# Altium schematic sheet TIDA-00620_Schematic.SchDoc: System Schematic
size 431 x 279 mm; Date: Not shown in title block; ApprovedBy: Not shown in title block; CheckedBy: Not shown in title block; Author: Not shown in title block; CompanyName: Not shown in title block; DrawnBy: Koh Hamasaki; Engineer: Not shown in title block; Organization: Not shown in title block; Address1: Not shown in title block; Address2: Not shown in title block; Address3: Not shown in title block; Address4: Not shown in title block; DocumentNumber: 1; Revision: Use project parameter SCH_Rev; SheetNumber: 1; SheetTotal: 2; PageSetup: Record=PageOptions|CenterHorizontal=True|CenterVertical=True|PrintScale=0.64|XCorrection=1.00|YCorrection=1.00|PrintKind=0|BorderSize=5000000|LeftOffset=0|BottomOffset=0|Orientation=2|PaperLength=1000|PaperWidth=1000|Scale=100|PaperSource=15|PrintQuality=600|MediaType=1|DitherType=10|PrintScaleMode=1|PaperKind=Letter; CurrentTime: Not shown in title block; CurrentDate: Not shown in title block; Time: Not shown in title block; DocumentFullPathAndName: Not shown in title block; DocumentName: Not shown in title block; ModifiedDate: Not shown in title block; ImagePath: Not shown in title block
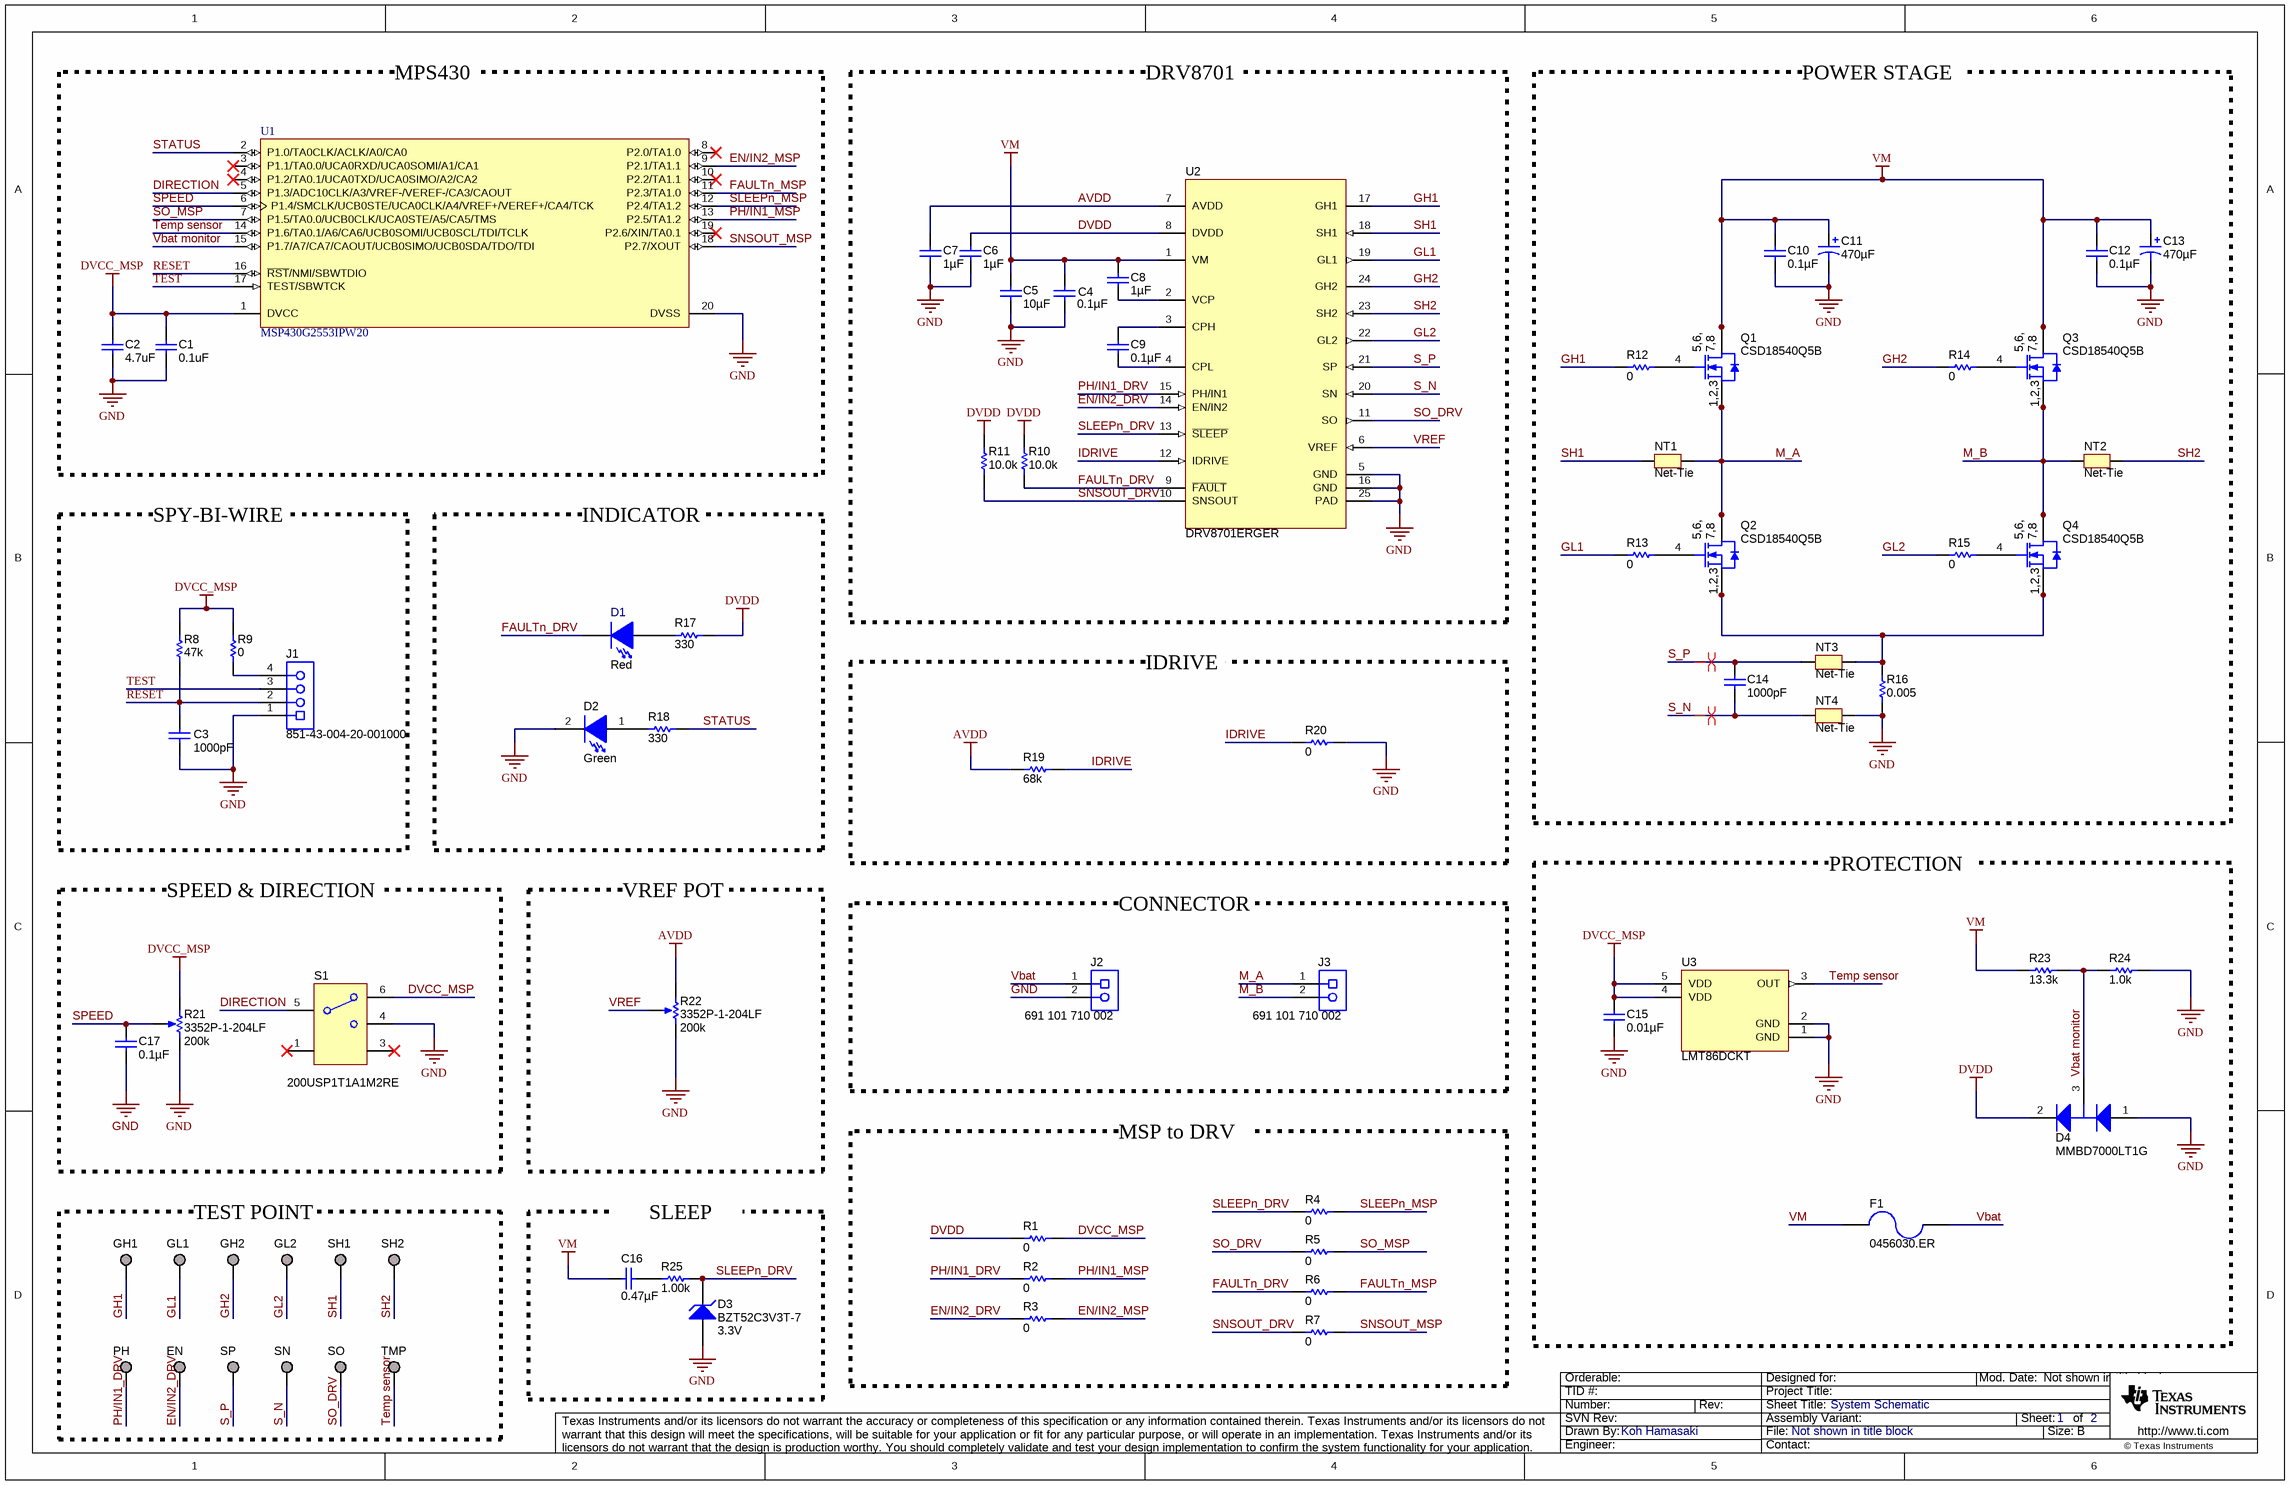
[diagram p0: TIDA-00620_Schematic.SchDoc]

## Parts
C1  ValueDisplayed: 0.1uF  [0603L]  (hidden comment: C0603C104K8RACTU)
C2  ValueDisplayed: 4.7uF  [0805L]  (hidden comment: C2012X7R1A475M)
C3  ValueDisplayed: 1000pF  [0603L]  (hidden comment: GRM188R71C102KA01D)
C4  ValueDisplayed: 0.1µF  [1206L]  (hidden comment: GRM319R71H104KA01D)
C5  ValueDisplayed: 10µF  [1210L]  (hidden comment: GRM32ER71H106KA12L)
C6  ValueDisplayed: 1µF  [0603L]  (hidden comment: GRM188R60J105KA01D)
C7  ValueDisplayed: 1µF  [0603L]  (hidden comment: GRM188R60J105KA01D)
C8  ValueDisplayed: 1µF  [1206L]  (hidden comment: GRM319R71C105KAA3D)
C9  ValueDisplayed: 0.1µF  [0402L]  (hidden comment: GRM155R71C104KA88D)
C10  ValueDisplayed: 0.1µF  [1206L]  (hidden comment: GRM319R71H104KA01D)
C11  ValueDisplayed: 470µF  [CAPPRD350W60D800H2000]  (hidden comment: EEU-FR1V471LB)
C12  ValueDisplayed: 0.1µF  [1206L]  (hidden comment: GRM319R71H104KA01D)
C13  ValueDisplayed: 470µF  [CAPPRD350W60D800H2000]  (hidden comment: EEU-FR1V471LB)
C14  ValueDisplayed: 1000pF  [0402L]  (hidden comment: GRM155R71C102KA01D)
C15  ValueDisplayed: 0.01µF  [0603L]  (hidden comment: GRM188R70J103KA01D)
C16  ValueDisplayed: 0.47µF  [0402L]  (hidden comment: GRM155R61A474KE15D)
C17  ValueDisplayed: 0.1µF  [0402]  (hidden comment: GCM155R71C104KA55D)
D1  value Red  [LED_LTST-C170]  (hidden comment: nFAULT)
D2  value Green  [LED_LTST-C171]  (hidden comment: LTST-C171GKT)
D3  BZT52C3V3T-7  value 3.3V  [SOD-523]
D4  MMBD7000LT1G  [SOT-23]
EN  TESTPOINT  [TP_25MIL-SMT]  (value not drawn)  (no BOM)
F1  0456030.ER  [FUSE_0456030]
GH1  TESTPOINT  [TP_25MIL-SMT]  (value not drawn)  (no BOM)
GH2  TESTPOINT  [TP_25MIL-SMT]  (value not drawn)  (no BOM)
GL1  TESTPOINT  [TP_25MIL-SMT]  (value not drawn)  (no BOM)
GL2  TESTPOINT  [TP_25MIL-SMT]  (value not drawn)  (no BOM)
J1  851-43-004-20-001000  [CONN_851-43-004-20-001000]
J2  691 101 710 002  [Wurth_691101710002]
J3  691 101 710 002  [Wurth_691101710002]
NT1  Net-Tie  [Net-Tie_10milWide_30milLong]  (net tie, no BOM)
NT2  Net-Tie  [Net-Tie_10milWide_30milLong]  (net tie, no BOM)
NT3  Net-Tie  [Net-Tie_10milWide_30milLong]  (net tie, no BOM)
NT4  Net-Tie  [Net-Tie_10milWide_30milLong]  (net tie, no BOM)
PH  TESTPOINT  [TP_25MIL-SMT]  (value not drawn)  (no BOM)
Q1  CSD18540Q5B  [TRANS_NexFET_Q5B]
Q2  CSD18540Q5B  [TRANS_NexFET_Q5B]
Q3  CSD18540Q5B  [TRANS_NexFET_Q5B]
Q4  CSD18540Q5B  [TRANS_NexFET_Q5B]
R1  ValueDisplayed: 0  [0402L]  (hidden comment: CRCW04020000Z0ED)
R2  ValueDisplayed: 0  [0402L]  (hidden comment: CRCW04020000Z0ED)
R3  ValueDisplayed: 0  [0402L]  (hidden comment: CRCW04020000Z0ED)
R4  ValueDisplayed: 0  [0402L]  (hidden comment: CRCW04020000Z0ED)
R5  ValueDisplayed: 0  [0402L]  (hidden comment: CRCW04020000Z0ED)
R6  ValueDisplayed: 0  [0402L]  (hidden comment: CRCW04020000Z0ED)
R7  ValueDisplayed: 0  [0402L]  (hidden comment: CRCW04020000Z0ED)
R8  value 47k  [0603L]  (hidden comment: CRCW060347K0JNEA)
R9  value 0  [0603L]  (hidden comment: CRCW06030000Z0EA)
R10  ValueDisplayed: 10.0k  [0402L]  (hidden comment: ERJ-2RKF1002X)
R11  ValueDisplayed: 10.0k  [0402L]  (hidden comment: ERJ-2RKF1002X)
R12  ValueDisplayed: 0  [0402L]  (hidden comment: CRCW04020000Z0ED)
R13  ValueDisplayed: 0  [0402L]  (hidden comment: CRCW04020000Z0ED)
R14  ValueDisplayed: 0  [0402L]  (hidden comment: CRCW04020000Z0ED)
R15  ValueDisplayed: 0  [0402L]  (hidden comment: CRCW04020000Z0ED)
R16  ValueDisplayed: 0.005  [4320]  (hidden comment: KRL11050-C-R005-F-T1)
R17  ValueDisplayed: 330  [0603L]  (hidden comment: RC0603FR-07330RL)
R18  ValueDisplayed: 330  [0603L]  (hidden comment: RC0603FR-07330RL)
R19  ValueDisplayed: 68k  [0402]  (hidden comment: CRCW040268K0JNED)
R20  ValueDisplayed: 0  [0402L]  (hidden comment: CRCW04020000Z0ED)
R21  3352P-1-204LF  value 200k  [Bourns_3352P]
R22  3352P-1-204LF  value 200k  [Bourns_3352P]
R23  ValueDisplayed: 13.3k  [0402L]  (hidden comment: CRCW040213K3FKED)
R24  ValueDisplayed: 1.0k  [0402L]  (hidden comment: CRCW04021K00JNED)
R25  ValueDisplayed: 1.00k  [0402L]  (hidden comment: CRCW04021K00FKED)
S1  200USP1T1A1M2RE  [SW_200USP1T1A1M2]
SH1  TESTPOINT  [TP_25MIL-SMT]  (value not drawn)  (no BOM)
SH2  TESTPOINT  [TP_25MIL-SMT]  (value not drawn)  (no BOM)
SN  TESTPOINT  [TP_25MIL-SMT]  (value not drawn)  (no BOM)
SO  TESTPOINT  [TP_25MIL-SMT]  (value not drawn)  (no BOM)
SP  TESTPOINT  [TP_25MIL-SMT]  (value not drawn)  (no BOM)
TMP  TESTPOINT  [TP_25MIL-SMT]  (value not drawn)  (no BOM)
U1  MSP430G2553IPW20  [PW0020A_N]
U2  DRV8701ERGER  [RGE0024F]
U3  LMT86DCKT  [DCK0005A_N]

## Nets
AVDD: C7.1 R19.1 R22.1(CCW) U2.7(AVDD)
DVCC_MSP: C1.1 C2.1 C15.1 R1.2 R8.2 R9.2 R21.1(CCW) S1.6 U1.1(DVCC) U3.4(VDD) U3.5(VDD)
DVDD: C6.1 D4.2(K) R1.1 R10.2 R11.2 R17.2 U2.8(DVDD)
GND: C1.2 C2.2 C3.2 C4.2 C5.2 C6.2 C7.2 C10.2 C11.2(-) C12.2 C13.2(-) C15.2 C17.2 D2.2(K) D3.2(A) D4.1(A) J1.1 J2.2 NT4.2 R16.1 R20.2 R21.3(CW) R22.3(CW) R24.2 S1.4 U1.20(DVSS) U2.5(GND) U2.16(GND) U2.25(PAD) U3.1(GND) U3.2(GND)
VM: C4.1 C5.1 C8.1 C10.1 C11.1(+) C12.1 C13.1(+) C16.2 F1.2 Q1.5(D) Q1.6(D) Q1.7(D) Q1.8(D) Q3.5(D) Q3.6(D) Q3.7(D) Q3.8(D) R23.1 U2.1(VM)
DIRECTION: S1.5(COM) U1.5(P1.3/ADC10CLK/A3/VREF-/VEREF-/CA3/CAOUT)
EN/IN2_DRV: EN.1 R3.1 U2.14(EN/IN2)
EN/IN2_MSP: R3.2 U1.9(P2.1/TA1.1)
FAULTn_DRV: D1.2(K) R6.1 R10.1 U2.9(~{FAULT})
FAULTn_MSP: R6.2 U1.11(P2.3/TA1.0)
GH1: GH1.1 R12.1 U2.17(GH1)
GH2: GH2.1 R14.1 U2.24(GH2)
GL1: GL1.1 R13.1 U2.19(GL1)
GL2: GL2.1 R15.1 U2.22(GL2)
IDRIVE: R19.2 R20.1 U2.12(IDRIVE)
M_A: J3.1 NT1.2 Q1.1(S) Q1.2(S) Q1.3(S) Q2.5(D) Q2.6(D) Q2.7(D) Q2.8(D)
M_B: J3.2 NT2.1 Q3.1(S) Q3.2(S) Q3.3(S) Q4.5(D) Q4.6(D) Q4.7(D) Q4.8(D)
PH/IN1_DRV: PH.1 R2.1 U2.15(PH/IN1)
PH/IN1_MSP: R2.2 U1.13(P2.5/TA1.2)
RESET: C3.1 J1.2 R8.1 U1.16(~{RST}/NMI/SBWTDIO)
S_N: C14.2 NT4.1 SN.1 U2.20(SN)
S_P: C14.1 NT3.1 SP.1 U2.21(SP)
SH1: NT1.1 SH1.1 U2.18(SH1)
SH2: NT2.2 SH2.1 U2.23(SH2)
SLEEPn_DRV: D3.1(K) R4.1 R25.2 U2.13(~{SLEEP})
SLEEPn_MSP: R4.2 U1.12(P2.4/TA1.2)
SNSOUT_DRV: R7.1 R11.1 U2.10(SNSOUT)
SNSOUT_MSP: R7.2 U1.18(P2.7/XOUT)
SO_DRV: R5.1 SO.1 U2.11(SO)
SO_MSP: R5.2 U1.7(P1.5/TA0.0/UCB0CLK/UCA0STE/A5/CA5/TMS)
SPEED: C17.1 R21.2(WIPER) U1.6(P1.4/SMCLK/UCB0STE/UCA0CLK/A4/VREF+/VEREF+/CA4/TCK)
STATUS: R18.2 U1.2(P1.0/TA0CLK/ACLK/A0/CA0)
Temp sensor: TMP.1 U1.14(P1.6/TA0.1/A6/CA6/UCB0SOMI/UCB0SCL/TDI/TCLK) U3.3(OUT)
TEST: J1.3 U1.17(TEST/SBWTCK)
Vbat: F1.1 J2.1
Vbat monitor: D4.3(C) R23.2 R24.1 U1.15(P1.7/A7/CA7/CAOUT/UCB0SIMO/UCB0SDA/TDO/TDI)
VREF: R22.2(WIPER) U2.6(VREF)
NetC8_2: C8.2 U2.2(VCP)
NetC9_1: C9.1 U2.3(CPH)
NetC9_2: C9.2 U2.4(CPL)
NetC16_1: C16.1 R25.1
NetD1_1: D1.1(A) R17.1
NetD2_1: D2.1(A) R18.1
NetJ1_4: J1.4 R9.1
NetNT3_2: NT3.2 Q2.1(S) Q2.2(S) Q2.3(S) Q4.1(S) Q4.2(S) Q4.3(S) R16.2
NetQ1_4: Q1.4(G) R12.2
NetQ2_4: Q2.4(G) R13.2
NetQ3_4: Q3.4(G) R14.2
NetQ4_4: Q4.4(G) R15.2

Not connected (* = marked no-connect by the designer): S1 1* 3*; U1 3(P1.1/TA0.0/UCA0RXD/UCA0SOMI/A1/CA1)* 4(P1.2/TA0.1/UCA0TXD/UCA0SIMO/A2/CA2)* 8(P2.0/TA1.0)* 10(P2.2/TA1.1)* 19(P2.6/XIN/TA0.1)*

## Layout directives
differential pair: S_N, S_P

## Notes on the sheet
- MPS430
- DRV8701
- POWER STAGE
- SPY-BI-WIRE
- INDICATOR
- IDRIVE
- SPEED & DIRECTION
- VREF POT
- PROTECTION
- CONNECTOR
- MSP to DRV
- TEST POINT
- SLEEP
- Drawn By:
- SVN Rev:
- Number:
- TID #:
- Orderable:
- Rev:
- Sheet Title:
- File:
- Project Title:
- Designed for:
- Assembly Variant:
- Mod. Date:
- Sheet:
- Size:
- of
- B
- http://www.ti.com
- Texas Instruments and/or its licensors do not warrant the accuracy or completeness of this specification or any information contained therein. Texas Instruments and/or its licensors do not warrant that this design will meet the specifications, will be suitable for your application or fit for any particular purpose, or will operate in an implementation. Texas Instruments and/or its licensors do not warrant that the design is production worthy. You should completely validate and test your design implementation to confirm the system functionality for your application.
- Engineer:
- Contact:
- © Texas Instruments
- (in symbol CSD18540Q5B) 5,6,; 7,8; 1,2,3

## Library data of the parts
C1 = C0603C104K8RACTU: CAP, CERM, 0.1uF, 10V, +/-10%, X7R, 0603; Manufacturer: Kemet; Polarized: N; CompType: Capacitor; U/M: EA; Cap_F: 0.0000001; Tolerance_%: 10; Value1: Unknown; TaMin_C: -55; TaMax_C: 125; Cap_Case: 0603; SymbolVersion: 2008-07-09; Value: 0.1uF; PartNumber: C0603C104K8RACTU; PackageReference: 0603; RoHS: Y; VDC_V: 10; Value2: 10V; MountType: SMT; Technology: Ceramic; TempCo: X7R; Published: 2008-06-19; Publisher: Texas Instruments; LatestRevisionDate: 2014-05-28; ComponentLink1Description: Datasheet link; ComponentLink1URL: http://www.kemet.com/kemet/web/homepage/kechome.nsf/vapubfiles/F3102_Y5V.pdf/$file/F3102_Y5V.pdf; Supplier 1: Digi-Key; Supplier Part Number 1: 399-1095-1-ND; Supplier 2: Mouser; Supplier Part Number 2: 80-C0603C104K8R; Supplier 3: Farnell; Supplier Part Number 3: 1640032
C2 = C2012X7R1A475M: CAP, CERM, 4.7uF, 10V, +/-20%, X7R, 0805; Manufacturer: TDK; Polarized: N; CompType: Capacitor; U/M: EA; Cap_F: 0.0000047; Tolerance_%: 20; Value1: Unknown; VDC_V: 10; TaMin_C: -55; TaMax_C: 125; Cap_Case: 0805; SymbolVersion: 2008-07-09; Value: 4.7uF; PartNumber: C2012X7R1A475M; PackageReference: 0805; RoHS: Y; Value2: 10V; MountType: SMT; Technology: Ceramic; TempCo: X7R; Published: 2008-06-19; Publisher: Texas Instruments; LatestRevisionDate: 2014-05-28; ComponentLink1Description: Datasheet link; ComponentLink1URL: http://www.tdk.co.jp/tefe02/e412_c.pdf; Supplier 1: Digi-Key; Supplier Part Number 1: 445-1605-1-ND; Supplier 2: Farnell; Supplier Part Number 2: 1844277
C3 = GRM188R71C102KA01D: CAP, CERM, 1000pF, 16V, +/-10%, X7R, 0603; Manufacturer: MuRata; Polarized: N; CompType: Capacitor; U/M: EA; Cap_F: 0.000000001; Tolerance_%: 10; Value1: Unknown; VDC_V: 16; TaMin_C: -55; TaMax_C: 125; Cap_Case: 0603; SymbolVersion: 2008-07-09; Value: 1000pF; PartNumber: GRM188R71C102KA01D; PackageReference: 0603; RoHS: Y; Value2: 16V; MountType: SMT; Technology: Ceramic; TempCo: X7R; Published: 2008-06-19; Publisher: Texas Instruments; LatestRevisionDate: 2014-05-28; ComponentLink1Description: Datasheet link; ComponentLink1URL: http://search.murata.co.jp/Ceramy/PnsearchViewAction.do?HnOFG=ON&HnNFG=ON&SEL_CNT=50&sLang=en&sKey=GRM188R71C102KA01D&x=9&y=9&search=startwith; Supplier 1: Digi-Key; Supplier Part Number 1: GRM188R71C102KA01D-ND; Supplier 2: Mouser; Supplier Part Number 2: 81-GRM188R71C102KA1D
C4 C10 C12 = GRM319R71H104KA01D: CAP, CERM, 0.1 µF, 50 V, +/- 10%, X7R, 1206; Manufacturer: MuRata; Polarized: N; CompType: Capacitor; Value: 0.1uF; U/M: EA; Cap_F: 0.0000001; Tolerance_%: 10; ESR_ohm: 0.01; Value1: 0.01 ohm; VDC_V: 50; Value2: 50V; IRMS_A: 0.9; TaMin_C: -55; TaMax_C: 125; Cap_Case: 1206; SymbolVersion: 2008-07-09; PartNumber: GRM319R71H104KA01D; PackageReference: 1206; RoHS: Y; MountType: SMT; Technology: Ceramic; TempCo: X7R; Published: 2008-06-19; Publisher: Texas Instruments; LatestRevisionDate: 2015-04-08; ComponentLink1Description: Datasheet link; ComponentLink1URL: http://www.murata.com/products/catalog/pdf/c02e.pdf; Supplier 1: Digi-Key; Supplier Part Number 1: 490-1775-1-ND; Supplier 2: Mouser; Supplier Part Number 2: 81-GRM426X104K50D; Supplier 3: Farnell; Supplier Part Number 3: 1828956
C5 = GRM32ER71H106KA12L: CAP, CERM, 10 µF, 50 V, +/- 10%, X7R, 1210; Manufacturer: MuRata; Polarized: N; CompType: Capacitor; Value: 10uF; U/M: EA; Cap_F: 0.00001; Tolerance_%: 10; Value1: Unknown; VDC_V: 50; Value2: 50V; TaMin_C: -55; TaMax_C: 125; Cap_Case: 1210; SymbolVersion: 2008-07-09; PartNumber: GRM32ER71H106KA12L; PackageReference: 1210; RoHS: Y; MountType: SMT; Technology: Ceramic; TempCo: X7R; Published: 2008-06-19; Publisher: Texas Instruments; LatestRevisionDate: 2015-04-23; ComponentLink1Description: Datasheet link; ComponentLink1URL: http://www.murata.com/products/catalog/pdf/c02e.pdf; Supplier 1: Digi-Key; Supplier Part Number 1: 490-6544-1-ND; Supplier 2: Mouser; Supplier Part Number 2: 81-GRM32ER71H106KA2L
C6 C7 = GRM188R60J105KA01D: CAP, CERM, 1 µF, 6.3 V, +/- 10%, X5R, 0603; Manufacturer: MuRata; Polarized: N; CompType: Capacitor; Value: 1uF; U/M: EA; Cap_F: 0.000001; Tolerance_%: 10; Value1: Unknown; VDC_V: 6.3; Value2: 6.3V; TaMin_C: -55; TaMax_C: 85; Cap_Case: 0603; SymbolVersion: 2008-07-09; PartNumber: GRM188R60J105KA01D; PackageReference: 0603; RoHS: Y; MountType: SMT; Technology: Ceramic; TempCo: X5R; Published: 2008-06-19; Publisher: Texas Instruments; LatestRevisionDate: 2015-04-08; ComponentLink1Description: Datasheet link; ComponentLink1URL: http://search.murata.co.jp/Ceramy/PnsearchViewAction.do?HnOFG=ON&HnNFG=ON&SEL_CNT=50&sLang=en&sKey=GRM188R60J105KA01D&x=9&y=9&search=startwith; Supplier 1: Digi-Key; Supplier Part Number 1: 490-1550-1-ND; Supplier 2: Mouser; Supplier Part Number 2: 81-GRM39R105K6.3; Supplier 3: Farnell; Supplier Part Number 3: 9527699
C8 = GRM319R71C105KAA3D: CAP, CERM, 1 µF, 16 V, +/- 10%, X7R, 1206; Manufacturer: MuRata; Polarized: N; CompType: Capacitor; Value: 1uF; U/M: EA; Cap_F: 0.000001; Tolerance_%: 10; Value1: Unknown; VDC_V: 16; Value2: 16V; TaMin_C: -55; TaMax_C: 125; Cap_Case: 1206; SymbolVersion: 2008-07-09; PartNumber: GRM319R71C105KAA3D; PackageReference: 1206; RoHS: Y; MountType: SMT; Technology: Ceramic; TempCo: X7R; Published: 2008-06-19; Publisher: Texas Instruments; LatestRevisionDate: 2015-04-08; ComponentLink1Description: Datasheet link; ComponentLink1URL: http://search.murata.co.jp/Ceramy/PnsearchViewAction.do?HnOFG=ON&HnNFG=ON&SEL_CNT=50&sLang=en&sKey=GRM319R71C105KAA3D&x=9&y=9&search=startwith; Supplier 1: Digi-Key; Supplier Part Number 1: GRM319R71C105KAA3D-ND; Supplier 2: Mouser; Supplier Part Number 2: 81-GRM319R71C105KA3D
C9 = GRM155R71C104KA88D: CAP, CERM, 0.1 µF, 16 V, +/- 10%, X7R, 0402; Manufacturer: MuRata; Polarized: N; CompType: Capacitor; Value: 0.1uF; U/M: EA; Cap_F: 0.0000001; Tolerance_%: 10; Value1: Unknown; VDC_V: 16; Value2: 16V; TaMin_C: -55; TaMax_C: 125; Cap_Case: 0402; SymbolVersion: 2008-07-09; PartNumber: GRM155R71C104KA88D; PackageReference: 0402; RoHS: Y; MountType: SMT; Technology: Ceramic; TempCo: X7R; Published: 2008-06-19; Publisher: Texas Instruments; LatestRevisionDate: 2015-04-08; ComponentLink1Description: Datasheet link; ComponentLink1URL: http://search.murata.co.jp/Ceramy/PnsearchViewAction.do?HnOFG=ON&HnNFG=ON&SEL_CNT=50&sLang=en&sKey=GRM155R71C104KA88D&x=9&y=9&search=startwith; Supplier 1: Digi-Key; Supplier Part Number 1: 490-3261-1-ND; Supplier 2: Mouser; Supplier Part Number 2: 81-GRM155R71C104KA88; Supplier 3: Farnell; Supplier Part Number 3: 8819742
C11 C13 = EEU-FR1V471LB: CAP, AL, 470 µF, 35 V, +/- 20%, 0.03 ohm, TH; Manufacturer: Panasonic; Polarized: Y; CompType: Capacitor; Value: 470uF; U/M: EA; Cap_F: 0.00047; Tolerance_%: 20; VDC_V: 35; Value2: 35V; ESR_ohm: 0.03; IRMS_A: 1.56; TaMin_C: -40; TaMax_C: 105; Cap_Case: CAPR_8x20mm; SymbolVersion: 2008-07-09; PartNumber: EEU-FR1V471LB; PackageReference: RCAP, 8x20mm; RoHS: Y; Value1: 0.03 ohm; MountType: TH; Technology: AL; Series: FR; Publisher: Texas Instruments; LatestRevisionDate: 2015-04-08; ComponentLink1Description: Datasheet link; ComponentLink1URL: http://industrial.panasonic.com/www-data/pdf/ABA0000/ABA0000CE132.pdf; Supplier 1: Digi-Key; Supplier Part Number 1: P15392CT-ND; Supplier 2: Mouser; Supplier Part Number 2: 667-EEU-FR1V471LB; Supplier 3: Newark; Supplier Part Number 3: 49W7477
C14 = GRM155R71C102KA01D: CAP, CERM, 1000pF, 16V, +/-10%, X7R, 0402; Manufacturer: MuRata; Polarized: N; CompType: Capacitor; U/M: EA; Cap_F: 0.000000001; Tolerance_%: 10; Value1: Unknown; VDC_V: 16; TaMin_C: -55; TaMax_C: 125; Cap_Case: 0402; SymbolVersion: 2008-07-09; Value: 1000pF; PartNumber: GRM155R71C102KA01D; PackageReference: 0402; RoHS: Y; Value2: 16V; MountType: SMT; Technology: Ceramic; TempCo: X7R; Published: 2008-06-19; Publisher: Texas Instruments; LatestRevisionDate: 2013-12-18; ComponentLink1Description: Datasheet link; ComponentLink1URL: http://search.murata.co.jp/Ceramy/PnsearchViewAction.do?HnOFG=ON&HnNFG=ON&SEL_CNT=50&sLang=en&sKey=GRM155R71C102KA01D&x=9&y=9&search=startwith; Supplier 1: Digi-Key; Supplier Part Number 1: GRM155R71C102KA01D-ND; Supplier 2: Mouser; Supplier Part Number 2: 81-GRM155R71C102KA1D
C15 = GRM188R70J103KA01D: CAP, CERM, 0.01 µF, 6.3 V, +/- 10%, X7R, 0603; Manufacturer: MuRata; Polarized: N; CompType: Capacitor; Value: 0.01uF; U/M: EA; Cap_F: 0.00000001; Tolerance_%: 10; Value1: Unknown; VDC_V: 6.3; Value2: 6.3V; TaMin_C: -55; TaMax_C: 125; Cap_Case: 0603; SymbolVersion: 2008-07-09; PartNumber: GRM188R70J103KA01D; PackageReference: 0603; RoHS: Y; MountType: SMT; Technology: Ceramic; TempCo: X7R; Published: 2008-06-19; Publisher: Texas Instruments; LatestRevisionDate: 2015-04-08; ComponentLink1Description: Datasheet link; ComponentLink1URL: http://search.murata.co.jp/Ceramy/PnsearchViewAction.do?HnOFG=ON&HnNFG=ON&SEL_CNT=50&sLang=en&sKey=GRM188R70J103KA01D&x=9&y=9&search=startwith; Supplier 1: Digi-Key; Supplier Part Number 1: GRM188R70J103KA01D-ND; Supplier 2: Mouser; Supplier Part Number 2: 81-GRM188R70J103KA1D
C16 = GRM155R61A474KE15D: CAP, CERM, 0.47 µF, 10 V, +/- 10%, X5R, 0402; Manufacturer: MuRata; Polarized: N; CompType: Capacitor; Value: 0.47uF; U/M: EA; Cap_F: 0.00000047; Tolerance_%: 10; Value1: Unknown; Value2: 10V; TaMin_C: -55; TaMax_C: 85; Cap_Case: 0402; SymbolVersion: 2008-07-09; PartNumber: GRM155R61A474KE15D; PackageReference: 0402; RoHS: Y; VDC_V: 10; MountType: SMT; Technology: Ceramic; TempCo: X5R; Published: 2008-06-19; Publisher: Texas Instruments; LatestRevisionDate: 2015-04-23; ComponentLink1Description: Datasheet link; ComponentLink1URL: http://search.murata.co.jp/Ceramy/PnsearchViewAction.do?HnOFG=ON&HnNFG=ON&SEL_CNT=50&sLang=en&sKey=GRM155R61A474KE15D&x=9&y=9&search=startwith; Supplier 1: Digi-Key; Supplier Part Number 1: 490-3264-1-ND; Supplier 2: Mouser; Supplier Part Number 2: 81-GRM155R61A474KE5D; Supplier 3: Farnell; Supplier Part Number 3: 1828863
C17 = GCM155R71C104KA55D: CAP, CERM, 0.1 µF, 16 V, +/- 10%, X7R, 0402; Manufacturer: MuRata; Polarized: N; CompType: Capacitor; Value: 0.1uF; U/M: EA; Cap_F: 0.0000001; Tolerance_%: 10; Value1: Unknown; VDC_V: 16; Value2: 16V; TaMin_C: -55; TaMax_C: 125; AEC Category: Q200; SymbolVersion: 2008-07-09; PartNumber: GCM155R71C104KA55D; PackageReference: 0402; RoHS: Y; MountType: SMT; Technology: Ceramic; TempCo: X7R; Cap_Case: 0402; Published: 2008-06-19; Publisher: Texas Instruments; LatestRevisionDate: 2015-08-15; ComponentLink1Description: Datasheet link; ComponentLink1URL: http://psearch.murata.com/capacitor/product/GCM155R71C104KA55%23.pdf; Supplier 1: Digi-Key; Supplier Part Number 1: 490-4759-2-ND; AEC Qualified: ?
D1 = LTST-C170KRKT: LED, Red, SMD; Manufacturer: Lite-On; DK Part Number: 160-1415-1-ND; Type: AlInGaP; Vf_V: 2; Value2: 2V; Value1: W; U/M: EA; CompType: LED; PartNumber: LTST-C170KRKT; SymbolVersion: 2008-12-08; MountType: SMT; RoHS: Y; PackageReference: LED_0805; Color: red; Published: 2008-07-11; Publisher: Texas Instruments; ComponentLink1URL: http://optoelectronics.liteon.com/en-us/api/DwonloadFileHandler.ashx?txtSpecNo=DS-22-99-0150&txtPartNo=LTST-C170KRKT; ComponentLink1Description: Datasheet link; LatestRevisionDate: 2013-07-10; LatestRevisionNote: Updated supplier queries; Supplier 1: Digi-Key; Supplier Part Number 1: 160-1415-1-ND; Supplier 2: Mouser; Supplier Part Number 2: 859-LTST-C170KRKT; MFG Part Number: LTST-C170KRKT
D2 = LTST-C171GKT: LED, Green, SMD; Manufacturer: Lite-On; Type: AlInGaP; Vf_V: 2.1; Value2: 2.1V; Io_A: 20; Value1: W; U/M: EA; CompType: LED; PartNumber: LTST-C171GKT; SymbolVersion: 2008-12-08; MountType: SMT; RoHS: Y; PackageReference: LED_0805; Color: green; Published: 2008-07-11; Publisher: Texas Instruments; ComponentLink1URL: https://sps06.itg.ti.com/sites/KMS/crossdivteams/altium/docs/ComponentDatasheets/LTST-C171GKT.pdf; ComponentLink1Description: Datasheet link; LatestRevisionDate: 2013-09-07; Supplier 1: Digi-Key; Supplier Part Number 1: 160-1423-1-ND; Supplier 2: Mouser; Supplier Part Number 2: 859-LTST-C171GKT
D3 = BZT52C3V3T-7: Diode, Zener, 3.3 V, 300 mW, SOD-523; Manufacturer: Diodes Inc.; SymbolCreator: a0412235; U/M: EA; Power_W: 0.3; Vz_V: 3.3; Value1: 0.3W; RJA_CperW: 417; SymbolVersion: 2010-08-25; PartNumber: BZT52C3V3T-7; PackageReference: SOD-523; CompType: Zener; Vr_V: N/A; MountType: SMT; RoHS: Y; ComponentLink1Description: Datasheet link; ComponentLink1URL: http://www.diodes.com/datasheets/ds30502.pdf; Published: 2008-10-08; Publisher: Texas Instruments; LatestRevisionDate: 2015-03-27; LatestRevisionNote: Updated Supplier Data; Supplier 1: Digi-Key; Supplier Part Number 1: BZT52C3V3T-7DICT-ND; Supplier 2: Mouser; Supplier Part Number 2: 621-BZT52C3V3T-7
D4 = MMBD7000LT1G: Diode, Switching, 100 V, 0.2 A, SOT-23; Manufacturer: ON Semiconductor; U/M: EA; Value: 100V; Value1: 0.2A; Io_A: 0.2; Vr_V: 100; TJmax_C: 150; SymbolVersion: 2011-08-17; PartNumber: MMBD7000LT1G; PackageReference: SOT-23; CompType: Diode; Value2: V; MountType: SMT; Type: Switching; RoHS: Y; Published: 2008-06-26; Publisher: Texas Instruments; LatestRevisionDate: 2015-04-26; ComponentLink1Description: Datasheet link; ComponentLink1URL: http://www.onsemi.com/pub_link/Collateral/MMBD7000LT1-D.PDF; Supplier 1: Digi-Key; Supplier Part Number 1: MMBD7000LT1GOSCT-ND; Supplier 2: Mouser; Supplier Part Number 2: 863-MMBD7000LT1G; Supplier 3: Farnell; Supplier Part Number 3: 2317661
EN GH1 GH2 GL1 GL2 PH SH1 SH2 SN SO SP TMP = TESTPOINT: TEST POINT.  No entry in BOM.; SymbolVersion: 2010-10-20; CompType: Testpoint; PackageReference: N/A; Publisher: Texas Instruments; LatestRevisionDate: 2014-12-30; LatestRevisionNote: Added Alternate PartNumber and Alternate Manufacturer parameters to appropriate components.
F1 = 0456030.ER: Fuse, 30 A, 72 V, SMD; Manufacturer: Littelfuse; U/M: EA; VDC_V: 72; VAC_V: 125; Irating_A: 30; Rtyp_Ohm: 0.00132; MeltingTyp: 81; Vdrop: 0.0699; SymbolVersion: 2008-07-09; PartNumber: 0456030.ER; PackageReference: 10.1x3.12mm; CompType: Fuse; Published: 2009-03-05; RoHS: Y; Publisher: Texas Instruments; LatestRevisionDate: 2015-04-28; ComponentLink1Description: Datasheet link; ComponentLink1URL: http://www.littelfuse.com/~/media/electronics/datasheets/fuses/littelfuse_fuse_456_datasheet.pdf.pdf; MountType: SMT; Supplier 1: Digi-Key; Supplier Part Number 1: F3345CT-ND; Supplier 2: Mouser; Supplier Part Number 2: 576-0456030.ER; Supplier 3: Farnell; Supplier Part Number 3: 1510911RL
J1 = 851-43-004-20-001000: SOCKET .050" GRID SIP 4 POS R/A, TH; Manufacturer: Mill-Max; SymbolCreator: a0411947; CompType: Header; U/M: EA; SymbolVersion: 2013-08-30; PartNumber: 851-43-004-20-001000; PackageReference: R/A 4x1 receptacle; RoHS: Y; MountType: TH; ComponentLink1Description: Datasheet Link; ComponentLink1URL: http://www.mill-max.com/images/products/pdf/metric/067M.pdf; Publisher: Texas Instruments; LatestRevisionDate: 2015-03-30; Supplier 1: Digi-Key; Supplier Part Number 1: ED90474-ND
J2 J3 = 691 101 710 002: Terminal Block, 5 mm, 2x1, Tin, TH; Manufacturer: Wurth Elektronik; SymbolCreator: a0412235; U/M: EA; SymbolVersion: 2013-09-04; PartNumber: 691 101 710 002; PackageReference: Terminal Block, 5 mm, 2x1, TH; CompType: Terminal Block; RoHS: Y; MountType: TH; ComponentLink1Description: Datasheet Link; ComponentLink1URL: http://katalog.we-online.de/em/datasheet/6911017100xx.pdf; Publisher: Texas Instruments; LatestRevisionDate: 2015-04-08; Supplier 1: Digi-Key; Supplier Part Number 1: 732-2026-ND; Supplier 2: Mouser; Supplier Part Number 2: 710-691101710002
NT1-NT4 = Net-Tie: Single point connection between nets.; SymbolCreator: codlsc; SymbolVersion: 2009-07-01; MountType: SMT; PackageReference: N/A; Publisher: Texas Instruments; LatestRevisionDate: 2014-12-30; LatestRevisionNote: Added Alternate PartNumber and Alternate Manufacturer parameters to appropriate components.
Q1-Q4 = CSD18540Q5B: MOSFET, N-CH, 60 V, 28 A, SON 5x6mm; Manufacturer: Texas Instruments; Alternate Manufacturer: None; U/M: EA; ChType: N; Value: 60V; VdsMax_V: 60; Value1: 0.0033 ohm; Rdson45_ohm: 0.0033; Value2: 41 nC; QgTyp_nC: 41; Vgs_V: 20; IdsMax_A: 28; SymbolVersion: 2008-07-09; CompType: MOSFET; PartNumber: CSD18540Q5B; PackageReference: SON 5x6mm; RoHS: Y; MountType: SMT; Published: 2008-06-19; Publisher: Texas Instruments; LatestRevisionDate: 2015-04-07; LatestRevisionNote: Added parts.; ComponentLink1Description: Datasheet link; ComponentLink1URL: http://www.ti.com/lit/ds/symlink/csd18540q5b.pdf
R1-R7 R12-R15 R20 = CRCW04020000Z0ED: RES, 0, 5%, 0.063 W, 0402; Manufacturer: Vishay-Dale; CompType: Resistor; Value: 0; Value_Code: 0000; Tolerance_%: 5; Power_W: 0.063; Value2: 0.063W; VDC_V: 50; TempCo: 200 ppm/C; EIA_Code: E24; U/M: EA; SymbolVersion: 2009-05-29; PartNumber: CRCW04020000Z0ED; PackageReference: 0402; RoHS: Y; Res_ohm: 0; Value1: 5%; MountType: SMT; Technology: Thick Film; Published: 2008-06-26; Publisher: Texas Instruments; LatestRevisionDate: 2015-02-16; ComponentLink1Description: Datasheet link; ComponentLink1URL: http://www.vishay.com/docs/20035/dcrcwe3.pdf; Supplier 1: Digi-Key; Supplier Part Number 1: 541-0.0JCT-ND; Supplier 2: Mouser; Supplier Part Number 2: 71-CRCW0402-0-E3; Supplier 3: Farnell; Supplier Part Number 3: 1469661
R8 = CRCW060347K0JNEA: RES, 47k ohm, 5%, 0.1W, 0603; Manufacturer: Vishay-Dale; CompType: Resistor; Res_ohm: 47000; Value_Code: 47k0; Tolerance_%: 5; Power_W: 0.1; VDC_V: 75; TempCo: 200 ppm/C; EIA_Code: E24; U/M: EA; SymbolVersion: 2009-05-29; PartNumber: CRCW060347K0JNEA; PackageReference: 0603; RoHS: Y; Value1: 5%; Value2: 0.1W; MountType: SMT; Technology: Thick Film; Published: 2008-06-26; Publisher: Texas Instruments; LatestRevisionDate: 2014-05-20; ComponentLink1Description: Datasheet link; ComponentLink1URL: http://www.vishay.com/docs/20035/dcrcwe3.pdf; Supplier 1: Digi-Key; Supplier Part Number 1: 541-47KGCT-ND; Supplier 2: Mouser; Supplier Part Number 2: 71-CRCW060347K0JNEA; Supplier 3: Farnell; Supplier Part Number 3: 1652881
R9 = CRCW06030000Z0EA: RES, 0 ohm, 5%, 0.1W, 0603; Manufacturer: Vishay-Dale; CompType: Resistor; Value_Code: 0000; Tolerance_%: 5; Power_W: 0.1; VDC_V: 75; TempCo: 200 ppm/C; EIA_Code: E24; U/M: EA; SymbolVersion: 2009-05-29; PartNumber: CRCW06030000Z0EA; PackageReference: 0603; RoHS: Y; Res_ohm: 0; Value1: 5%; Value2: 0.1W; MountType: SMT; Technology: Thick Film; Published: 2008-06-26; Publisher: Texas Instruments; LatestRevisionDate: 2014-05-20; ComponentLink1Description: Datasheet link; ComponentLink1URL: http://www.vishay.com/docs/20035/dcrcwe3.pdf; Supplier 1: Digi-Key; Supplier Part Number 1: 541-0.0GCT-ND; Supplier 2: Mouser; Supplier Part Number 2: 71-CRCW0603-0-E3; Supplier 3: Farnell; Supplier Part Number 3: 1469739
R10 R11 = ERJ-2RKF1002X: RES, 10.0 k, 1%, 0.1 W, 0402; Manufacturer: Panasonic; CompType: Resistor; Value: 10.0k; Res_ohm: 10000; Value_Code: 10k0; Tolerance_%: 1; Power_W: 0.1; Value2: 0.1W; VDC_V: 50; TempCo: 100 ppm/C; EIA_Code: E96; U/M: EA; SymbolVersion: 2009-05-29; PartNumber: ERJ-2RKF1002X; PackageReference: 0402; RoHS: Y; Value1: 1%; MountType: SMT; Technology: Thick Film; Published: 2008-06-26; Publisher: Texas Instruments; LatestRevisionDate: 2015-02-16; ComponentLink1Description: Datasheet link; ComponentLink1URL: http://industrial.panasonic.com/www-data/pdf/AOA0000/AOA0000CE2.pdf; Supplier 1: Digi-Key; Supplier Part Number 1: P10.0KLCT-ND; Supplier 2: Mouser; Supplier Part Number 2: 667-ERJ-2RKF1002X
R16 = KRL11050-C-R005-F-T1: RES, 0.005, 1%, 6 W, 4320_WIDE; Manufacturer: Susumu Co Ltd; CompType: Resistor; Value: 0.005; Value_Code: 5L000; Tolerance_%: 1; Power_W: 6; Value2: 6W; TempCo: 50 ppm/C; EIA_Code: E96; U/M: EA; SymbolVersion: 2009-05-29; PartNumber: KRL11050-C-R005-F-T1; PackageReference: 4320_WIDE; RoHS: Y; Res_ohm: 0.005; Value1: 1%; MountType: SMT; Technology: Metal Element; Published: 2008-06-26; Publisher: Texas Instruments; LatestRevisionDate: 2015-03-28; ComponentLink1Description: Datasheet link; ComponentLink1URL: http://www.susumu-usa.com/pdf/KRL_New_Long_Data_sheet.pdf; Supplier 1: Digi-Key; Supplier Part Number 1: KRL11C.005CT-ND
R17 R18 = RC0603FR-07330RL: RES, 330, 1%, 0.1 W, 0603; Manufacturer: Yageo America; CompType: Resistor; Value: 330; Value_Code: 330R; Tolerance_%: 1; Power_W: 0.1; Value2: 0.1W; VDC_V: 150; TempCo: 200 ppm/C; U/M: EA; SymbolVersion: 2009-05-29; PartNumber: RC0603FR-07330RL; PackageReference: 0603; RoHS: Y; Res_ohm: 330; Value1: 1%; MountType: SMT; Technology: Thick Film; Published: 2008-06-26; Publisher: Texas Instruments; LatestRevisionDate: 2015-02-25; ComponentLink1Description: Datasheet link; ComponentLink1URL: http://www.yageo.com/pdf/Pu-RC0603_51_PbFree_L_2.pdf; Supplier 1: Digi-Key; Supplier Part Number 1: 311-330HRCT-ND; Supplier 2: Mouser; Supplier Part Number 2: 603-RC0603FR-07330RL; Supplier 3: Farnell; Supplier Part Number 3: 9238425
R19 = CRCW040268K0JNED: RES, 68 k, 5%, 0.063 W, 0402; Manufacturer: Vishay-Dale; CompType: Resistor; Value: 68k; Res_ohm: 68000; Value_Code: 68k0; Tolerance_%: 5; Power_W: 0.063; Value2: 0.063W; VDC_V: 50; TempCo: 200 ppm/C; EIA_Code: E24; U/M: EA; SymbolVersion: 2009-05-29; PartNumber: CRCW040268K0JNED; PackageReference: 0402; RoHS: Y; Value1: 5%; MountType: SMT; Technology: Thick Film; Published: 2008-06-26; Publisher: Texas Instruments; LatestRevisionDate: 2015-08-08; ComponentLink1Description: Datasheet link; ComponentLink1URL: http://www.vishay.com/docs/20035/dcrcwe3.pdf; Supplier 1: Digi-Key; Supplier Part Number 1: 541-68KJCT-ND; Supplier 2: Mouser; Supplier Part Number 2: 71-CRCW0402J-68K-E3; Supplier 3: Farnell; Supplier Part Number 3: 1570689
R21 R22 = 3352P-1-204LF: Trimmer, 200 K, 0.5 W, TH; Manufacturer: Bourns; Sim Note: Enter the Resistance value and the set point into parameter fields.; SymbolCreator: a0412235; SymbolVersion: 2012-12-27; PartNumber: 3352P-1-204LF; CompType: Trimmer; MountType: TH; ComponentLink1Description: Datasheet Link; ComponentLink1URL: http://www.bourns.com/data/global/PDFs/3352.pdf; RoHS: Y; PackageReference: Thumbwheel Trimmer; Publisher: Texas Instruments; LatestRevisionDate: 2015-03-31; Supplier 1: Digi-Key; Supplier Part Number 1: 3352P-204LF-ND; Supplier 2: Mouser; Supplier Part Number 2: 652-3352P-1-204
R23 = CRCW040213K3FKED: RES, 13.3 k, 1%, 0.063 W, 0402; Manufacturer: Vishay-Dale; CompType: Resistor; Value: 13.3k; Res_ohm: 13300; Value_Code: 13k3; Tolerance_%: 1; Power_W: 0.063; Value2: 0.063W; VDC_V: 50; TempCo: 100 ppm/C; EIA_Code: E96; U/M: EA; SymbolVersion: 2009-05-29; PartNumber: CRCW040213K3FKED; PackageReference: 0402; RoHS: Y; Value1: 1%; MountType: SMT; Technology: Thick Film; Published: 2008-06-26; Publisher: Texas Instruments; LatestRevisionDate: 2015-02-16; ComponentLink1Description: Datasheet link; ComponentLink1URL: http://www.vishay.com/docs/20035/dcrcwe3.pdf; Supplier 1: Digi-Key; Supplier Part Number 1: 541-13.3KLCT-ND; Supplier 2: Mouser; Supplier Part Number 2: 71-CRCW0402-13.3K-E3; Supplier 3: Farnell; Supplier Part Number 3: 1652750
R24 = CRCW04021K00JNED: RES, 1.0 k, 5%, 0.063 W, 0402; Manufacturer: Vishay-Dale; CompType: Resistor; Value: 1.0k; Res_ohm: 1000; Value_Code: 1k00; Tolerance_%: 5; Power_W: 0.063; Value2: 0.063W; VDC_V: 50; TempCo: 200 ppm/C; EIA_Code: E24; U/M: EA; SymbolVersion: 2009-05-29; PartNumber: CRCW04021K00JNED; PackageReference: 0402; RoHS: Y; Value1: 5%; MountType: SMT; Technology: Thick Film; Published: 2008-06-26; Publisher: Texas Instruments; LatestRevisionDate: 2015-02-16; ComponentLink1Description: Datasheet link; ComponentLink1URL: http://www.vishay.com/docs/20035/dcrcwe3.pdf; Supplier 1: Digi-Key; Supplier Part Number 1: 541-1.0KJCT-ND; Supplier 2: Mouser; Supplier Part Number 2: 71-CRCW0402J-1.0K-E3; Supplier 3: Farnell; Supplier Part Number 3: 1514656
R25 = CRCW04021K00FKED: RES, 1.00 k, 1%, 0.063 W, 0402; Manufacturer: Vishay-Dale; CompType: Resistor; Value: 1.00k; Res_ohm: 1000; Value_Code: 1k00; Tolerance_%: 1; Power_W: 0.063; Value2: 0.063W; VDC_V: 50; TempCo: 100 ppm/C; EIA_Code: E96; U/M: EA; SymbolVersion: 2009-05-29; PartNumber: CRCW04021K00FKED; PackageReference: 0402; RoHS: Y; Value1: 1%; MountType: SMT; Technology: Thick Film; Published: 2008-06-26; Publisher: Texas Instruments; LatestRevisionDate: 2015-04-27; ComponentLink1Description: Datasheet link; ComponentLink1URL: http://www.vishay.com/docs/20035/dcrcwe3.pdf; Supplier 1: Digi-Key; Supplier Part Number 1: 541-1.00KLCT-ND; Supplier 2: Mouser; Supplier Part Number 2: 71-CRCW0402-1.0K-E3; Supplier 3: Farnell; Supplier Part Number 3: 1469662
S1 = 200USP1T1A1M2RE: Switch, SPDT, On-On, 2 Pos, TH; Manufacturer: E-Switch; SymbolCreator: Altium; VDC_V: 20; PositionCount: 2; CurrentRating_mA: 400; SymbolVersion: 2015-03-05; PartNumber: 200USP1T1A1M2RE; MountType: TH; ComponentLink1Description: Datasheet URL; ComponentLink1URL: http://spec_sheets.e-switch.com/specs/T250000.pdf; RoHS: Y; Circuit: SPDT; SwitchFunction: On-On; Orientation: Top Actuated; CompType: Switch; PackageReference: Switch, 7x4.5mm; Publisher: Texas Instruments; LatestRevisionDate: 2015-03-31; Supplier 1: Digi-Key; Supplier Part Number 1: EG4915-ND; Supplier 2: Mouser; Supplier Part Number 2: 612-200USP1T1A1M2RE
U1 = MSP430G2553IPW20: 16 MHz Mixed Signal Microcontroller with 16 KB Flash, 512 B SRAM and 24 GPIOs, -40 to 85 degC, 20-pin SOP (PW), Green (RoHS & no Sb/Br); Alternate Manufacturer: Texas Instruments; Alternate PartNumber: Equivalent; ADC: 10-bit SAR; ADC Channels: 8; Brown Out Reset: Yes; Flash(KB): 16; GPIO: 24; Pin/Package: 0DIESALE, 0WAFERSALE, 20PDIP, 20TSSOP, 28TSSOP, 32QFN; SRAM(B): 512; SubFamily: Value Line; Timers - 16-bit: 2; USCI_A (UART/LIN/IrDA/SPI): 1; DatasheetVersion: SLAS735G; PackageVersion: 4040064-5/G, 02/2011; PackageReference: PW0020A; PackageDescription: 20-Pin Plastic Small Outline, Body 6.5 x 4.4 mm, Pitch 0.65 mm; Cap touch I/O: Yes; Comparators: Yes; Eco-Plan: Green (RoHS & no Sb/Br); Frequency(MHz): 16; Temp Sensor: Yes; USCI_B (I2C & SPI): 1; Watchdog: Yes; MountType: SMT; Code_JEDEC: MO-153; ComponentLink1Description: Manufacturer URL; ComponentLink1URL: http://www.ti.com/; ComponentLink2Description: Datasheet; ComponentLink2URL: http://www.ti.com/general/docs/lit/getliterature.tsp?genericPartNumber=MSP430G2553&fileType=pdf; PartNumber: MSP430G2553IPW20; Manufacturer: Texas Instruments
U2 = DRV8701ERGER: H-Bridge Gate Driver, RGE0024F; Alternate PartNumber: DRV8701ERGET; Manufacturer: Texas Instruments; SymbolCreator: Altium; CompType: IC; U/M: EA; SymbolVersion: 2015-02-10; PartNumber: DRV8701ERGER; PackageReference: RGE0024F; MountType: SMT; ComponentLink1Description: Datasheet Link; ComponentLink1URL: https://sps06.itg.ti.com/sites/KMS/crossdivteams/altium/docs/ComponentDatasheets/DRV8701_011615.pdf; Publisher: Texas Instruments; LatestRevisionDate: 2015-04-08; Alternate Manufacturer: Texas Instruments
U3 = LMT86DCKT: Analog Temperature Sensors with Class-AB Output, DCK0005A; Manufacturer: Texas Instruments; SymbolCreator: a0799628; CompType: IC; U/M: EA; SymbolVersion: 2013-08-16; PartNumber: LMT86DCKT; PackageReference: DCK0005A; MountType: SMT; ComponentLink1Description: Datasheet Link; ComponentLink1URL: http://www.ti.com/product/lmt86; RoHS: Y; Publisher: Texas Instruments; LatestRevisionDate: 2015-04-08; Alternate Manufacturer: Texas Instruments